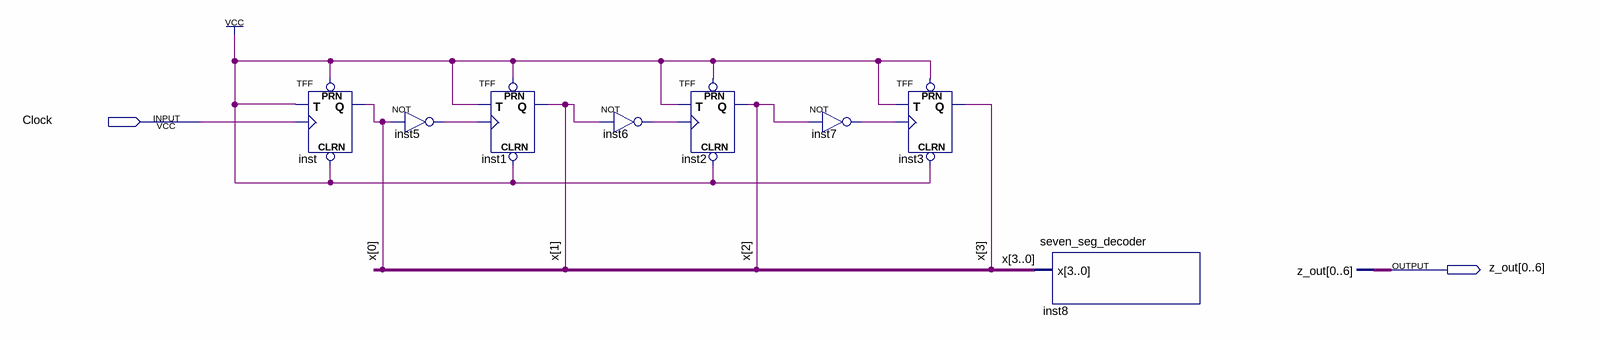
[diagram p0: schematic sheet]
// Quartus schematic lab10step3a.bdf as structural Verilog: 8 symbols, 2 pins
module lab10step3a (
  input  Clock,
  output [0:6] z_out
);

  wire inst5_out, inst6_out, inst7_out;
  wire [3:0] x;

  TFF inst (.PRN(1'b1), .CLRN(1'b1), .T(1'b1), .CLK(Clock), .Q(x[0]));
  not inst5 (inst5_out, x[0]);
  TFF inst1 (.PRN(1'b1), .CLRN(1'b1), .T(1'b1), .CLK(inst5_out), .Q(x[1]));
  not inst6 (inst6_out, x[1]);
  TFF inst2 (.PRN(1'b1), .CLRN(1'b1), .T(1'b1), .CLK(inst6_out), .Q(x[2]));
  not inst7 (inst7_out, x[2]);
  TFF inst3 (.PRN(1'b1), .CLRN(1'b1), .T(1'b1), .CLK(inst7_out), .Q(x[3]));
  seven_seg_decoder inst8 (.x(x), .z_out(z_out));
endmodule
